# Altium schematic sheet [10]-MAIN_POWER.SchDoc
size A4
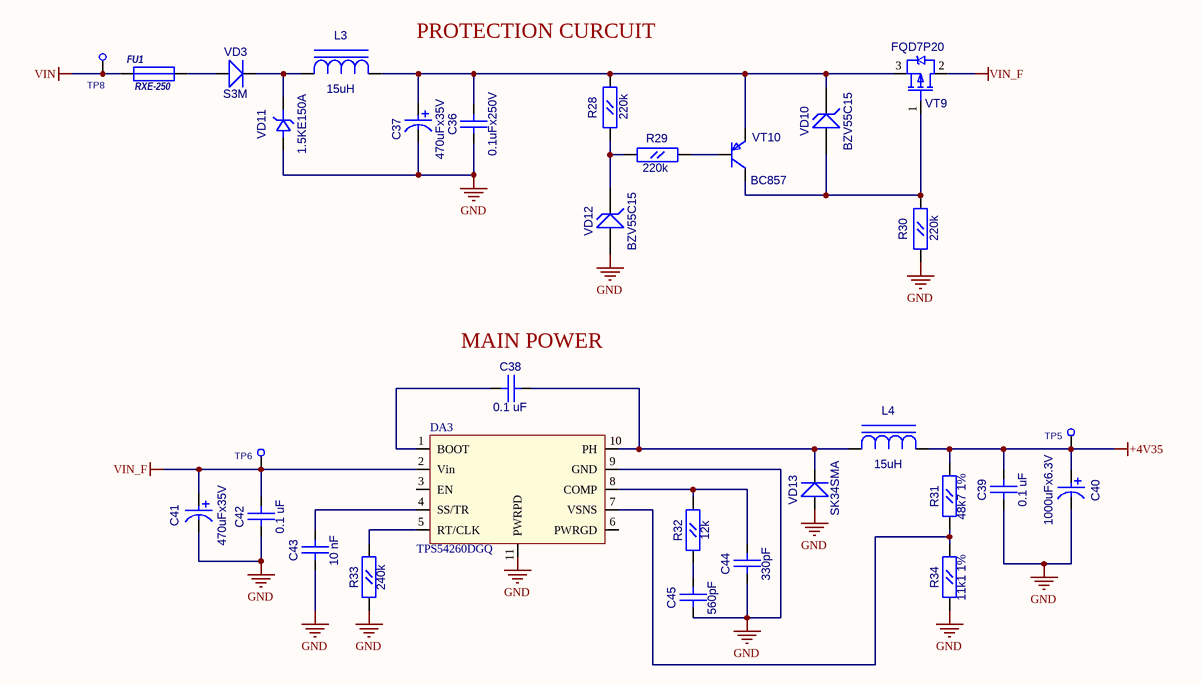
[diagram p0: [10]-MAIN_POWER.SchDoc]

## Parts
C36  0.1uFx250V  [CC1206]
C37  value 470uFx35V  [CC16X10_CAP0.5(1)(Primary)]  (hidden comment: CAP0.5(1))
C38  0.1 uF  [CC0603]
C39  0.1 uF  [CC0603]
C40  1000uFx6.3V  [CC8X3.5]
C41  470uFx35V  [CC16X10_CAP0.5(1)(Primary)]
C42  0.1 uF  [CC0603]
C43  10 nF  [CC0603]
C44  330pF  [CC0603]
C45  560pF  [CC0603]
DA3  TPS54260DGQ  [S-PDSO-G10]
FU1  RXE-250  [RXE-185]
L3  value 15uH  [SDR0805]  (hidden comment: SDR0805)
L4  15uH  [SDR0805]
R28  220k  [RC0603]
R29  220k  [RC0603]
R30  220k  [RC0603]
R31  48k7 1%  [RC0603]
R32  12k  [RC0603]
R33  240k  [RC0603]
R34  11k1 1%  [RC0603]
TP5  TESTPOINT1  [TESTPOINT1]  (value not drawn)
TP6  TESTPOINT1  [TESTPOINT1]  (value not drawn)
TP8  TESTPOINT1  [TESTPOINT1]  (value not drawn)
VD3  S3M  [SMC]
VD10  BZV55C15  [SOD-80]
VD11  1.5KE150A  [DO-201]
VD12  BZV55C15  [SOD-80]
VD13  SK34SMA  [SMA]
VT9  FQD7P20  [D-PAK(TO-252AA)]
VT10  BC857  [SOT-23(123)]

## Nets
+4V35: C39.1(A) C40.1 L4.2(A) R31.2(B) TP5.1
GND: C36.1(A) C37.1 C39.2(B) C40.2 C41.1 C42.2(B) C43.2(B) C44.2(B) C45.2(B) DA3.9(GND) DA3.11(PWRPD) R30.1(A) R33.1(A) R34.1(A) VD11.1(A) VD12.1(A) VD13.1(A)
VIN: FU1.1 TP8.1
VIN_F: C41.2 C42.1(A) DA3.2(Vin) TP6.1 VT9.2(D)
NetC36_2: C36.2(B) C37.2 L3.2(A) R28.2(B) VD10.2 VT9.3(S) VT10.2(E)
NetC38_1: C38.1(A) DA3.10(PH) L4.1(C) VD13.2(K)
NetC38_2: C38.2(B) DA3.1(BOOT)
NetC43_1: C43.1(A) DA3.4(SS/TR)
NetC44_1: C44.1(A) DA3.8(COMP) R32.2(B)
NetC45_1: C45.1(A) R32.1(A)
NetDA3_5: DA3.5(RT/CLK) R33.2(B)
NetDA3_7: DA3.7(VSNS) R31.1(A) R34.2(B)
NetFU1_2: FU1.2 VD3.1(A)
NetL3_1: L3.1(C) VD3.2(K) VD11.2(K)
NetR28_1: R28.1(A) R29.2(B) VD12.2
NetR29_1: R29.1(A) VT10.1(B)
NetR30_2: R30.2(B) VD10.1(A) VT9.1(G) VT10.3(C)

Not connected (* = marked no-connect by the designer): DA3 3(EN) 6(PWRGD)

## Notes on the sheet
- PROTECTION CURCUIT
- (near C38) MAIN POWER

## Library data of the parts
C36 = CC1206: Value: 0.1uFx250V
C38 C39 C42-C45 = CC0603
  C38 C39 C42: Value: 0.1 uF
  C43: Value: 10 nF
  C44: Value: 330pF
  C45: Value: 560pF
C40 = CAP0.35: Value: 1000uFx6.3V
C41 = CAP0.5(1): Value: 470uFx35V
FU1 = RXE-185: Value: *
L4 = SDR0805: Value: 15uH
R28-R34 = RC0603
  R28-R30: Value: 220k
  R31: Value: 48k7 1%
  R32: Value: 12k
  R33: Value: 240k
  R34: Value: 11k1 1%
VD3 = S3A: Schottky Rectifier; Value: S3M
VD10 = BZV55C12: Zener Voltage Regulator Diode; Value: BZV55C15
VD11 = 1.5KE: Value: 1.5KE150A
VD12 = BZV55C12: Zener Voltage Regulator Diode; OriginalName: BXV55C39; ComponentField6: Pin 2 is not connected and not drawn.; ComponentField7: Published 29-Sep-2000; Value: BZV55C15
VD13 = SK34SMA: Schottky Rectifier; Value: {Value}
VT9 = IRFR9220: HEXFET Power MOSFET; OriginalName: IRLML5103; ComponentField7: Published 8-Jun-2000; Value: FQD7P20
VT10 = BC857B: PNP 100ma transistor; OriginalName: BC846BLT1; ComponentField7: Published 29-Sep-2000; Value: BC857
TP5 TP6 TP8 = TESTPOINT1: Value: *